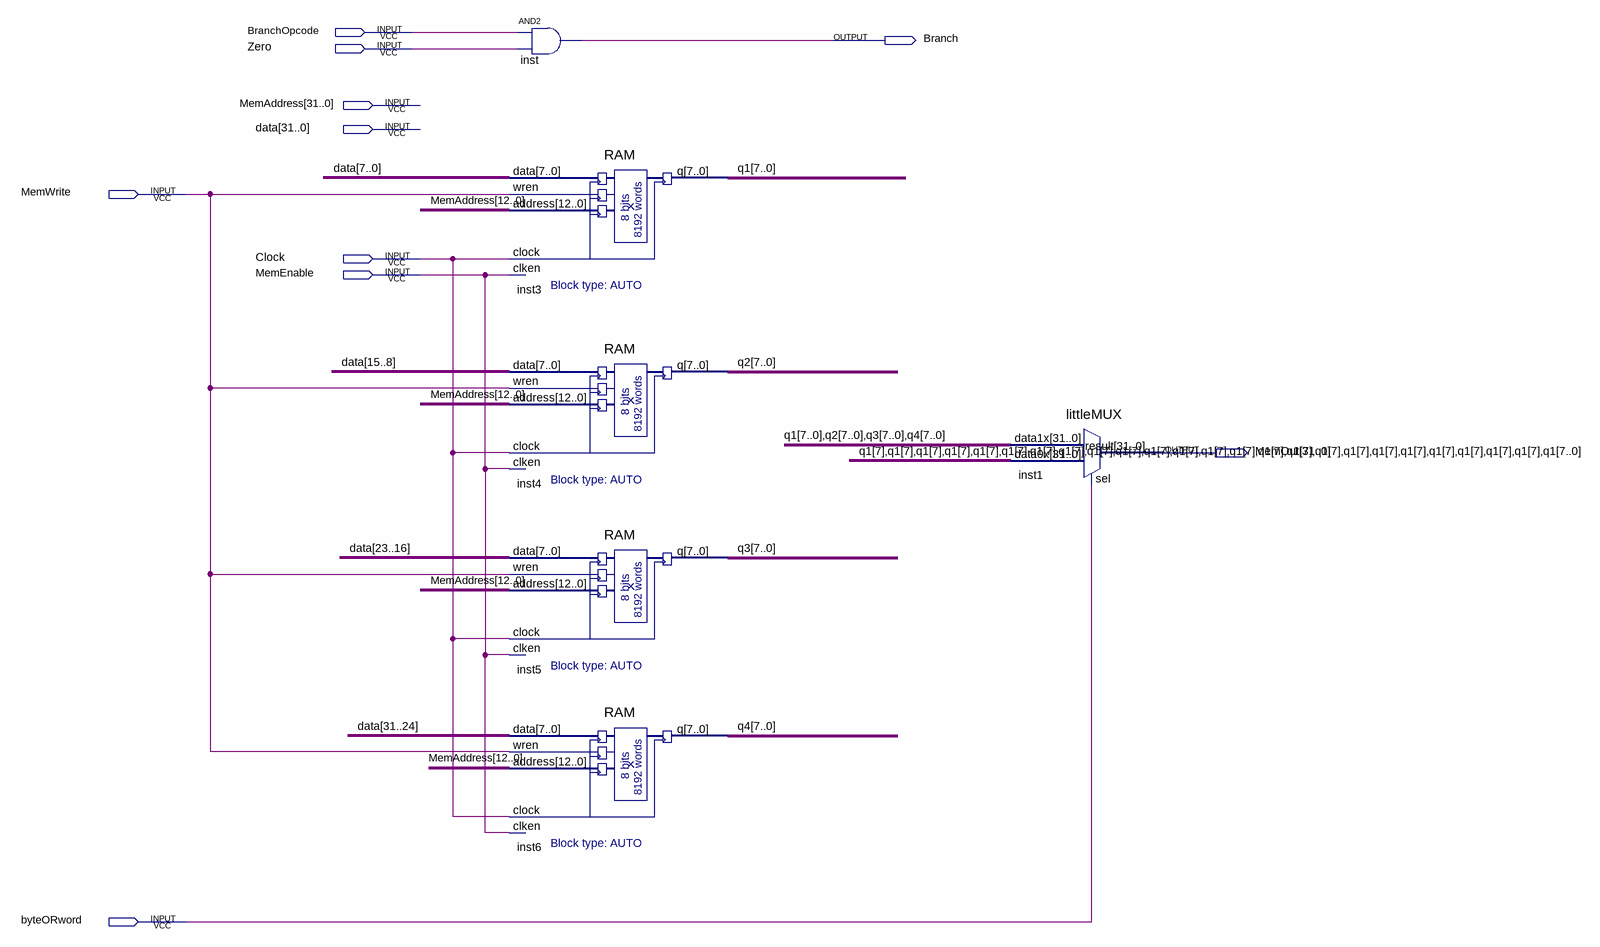
[diagram p0: schematic sheet]
// Quartus schematic MemoryLevel.bdf as structural Verilog: 6 symbols, 10 pins
module MemoryLevel (
  input  BranchOpcode,
  input  Zero,
  input  [31:0] MemAddress,
  input  [31:0] data,
  input  MemWrite,
  input  Clock,
  input  MemEnable,
  input  byteORword,
  output Branch,
  output [31:0] MemOut
);

  wire [7:0] q1, q2, q3, q4;

  and inst (Branch, BranchOpcode, Zero);
  RAM inst3 (.data(data[7:0]), .wren(MemWrite), .address(MemAddress[12:0]), .clock(Clock), .clken(MemEnable), .q(q1));
  RAM inst4 (.data(data[15:8]), .wren(MemWrite), .address(MemAddress[12:0]), .clock(Clock), .clken(MemEnable), .q(q2));
  RAM inst5 (.data(data[23:16]), .wren(MemWrite), .address(MemAddress[12:0]), .clock(Clock), .clken(MemEnable), .q(q3));
  RAM inst6 (.data(data[31:24]), .wren(MemWrite), .address(MemAddress[12:0]), .clock(Clock), .clken(MemEnable), .q(q4));
  littleMUX inst1 (.data1x({q1, q2, q3, q4}), .data0x({{25{q1[7]}}, q1[6:0]}), .sel(byteORword), .result(MemOut));
endmodule
